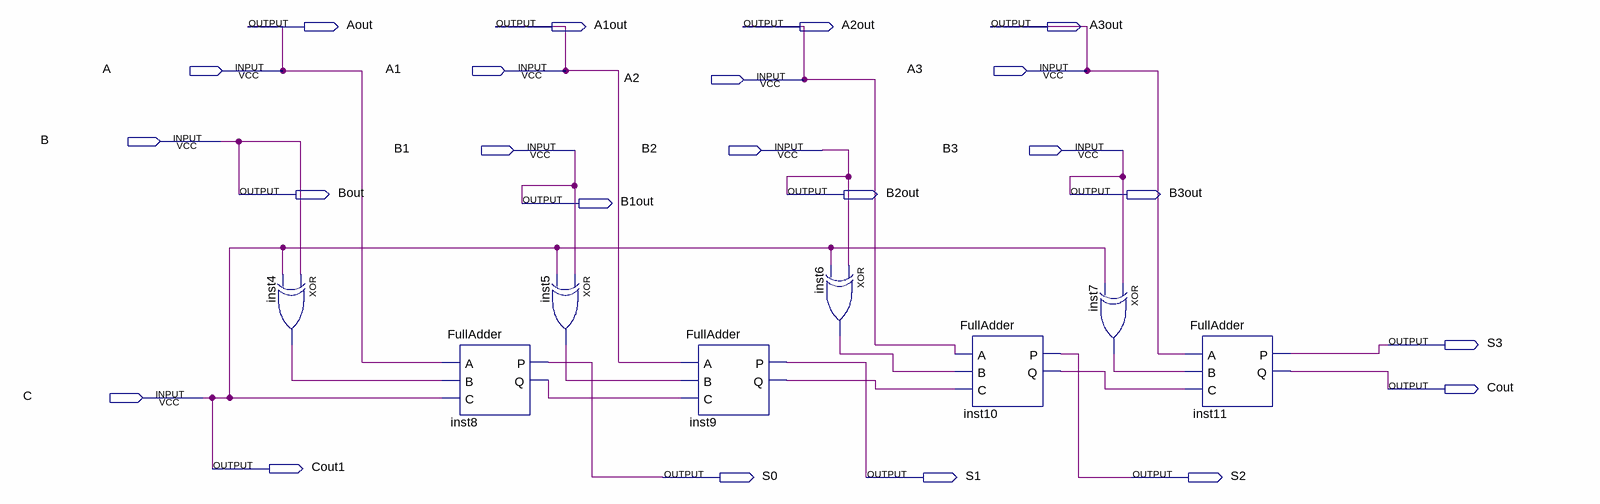
[diagram p0: schematic sheet]
// Quartus schematic RippleCarryAdderSub.bdf as structural Verilog: 8 symbols, 23 pins
module RippleCarryAdderSub (
  input  A,
  input  A1,
  input  A3,
  input  A2,
  input  B,
  input  B1,
  input  B2,
  input  B3,
  input  C,
  output Aout,
  output A1out,
  output A2out,
  output A3out,
  output Bout,
  output B2out,
  output B3out,
  output B1out,
  output S3,
  output Cout,
  output Cout1,
  output S0,
  output S1,
  output S2
);

  wire inst4_out, inst5_out, inst6_out, inst7_out, inst8_q, inst9_q, inst10_q;

  xor inst4 (inst4_out, B, C);
  FullAdder inst8 (.A(A), .B(inst4_out), .C(C), .P(S0), .Q(inst8_q));
  xor inst5 (inst5_out, B1, C);
  FullAdder inst9 (.A(A1), .B(inst5_out), .C(inst8_q), .P(S1), .Q(inst9_q));
  xor inst6 (inst6_out, B2, C);
  FullAdder inst10 (.A(A2), .B(inst6_out), .C(inst9_q), .P(S2), .Q(inst10_q));
  xor inst7 (inst7_out, B3, C);
  FullAdder inst11 (.A(A3), .B(inst7_out), .C(inst10_q), .P(S3), .Q(Cout));

  assign A1out = A1;
  assign A2out = A2;
  assign A3out = A3;
  assign Aout = A;
  assign B1out = B1;
  assign B2out = B2;
  assign B3out = B3;
  assign Bout = B;
  assign Cout1 = C;
endmodule
